# EAGLE design ESP-07 (EAGLE 7.7.0)
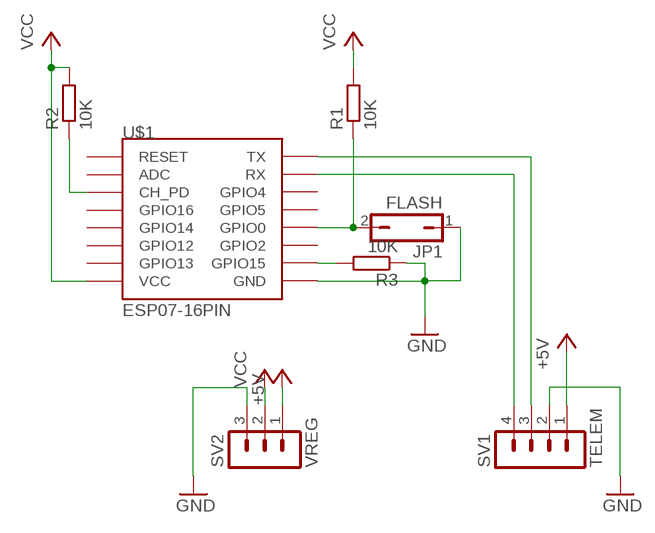
[diagram p0: schematic, sheet 1]

## Parts
JP1  FLASH  JP1Q  [JP1]
R1  10K  R-EU_R0805  [R0805]
R2  10K  R-EU_R0805  [R0805]
R3  10K  R-EU_R0805  [R0805]
SV1  TELEM  MA04-1  [MA04-1]
SV2  VREG  MA03-1  [MA03-1]
U$1  ESP07-16PIN  [ESP07-16PIN]

## Nets
+5V: SV1.1 SV2.1
GND: JP1.1 R3.1 SV1.2 SV2.3 U$1.GND
N$1: JP1.2 R1.1 U$1.GPIO0
N$2: SV1.3 U$1.TX
N$3: SV1.4 U$1.RX
N$4: R3.2 U$1.GPIO15
N$6: R2.1 U$1.CH_PD
VCC: R1.2 R2.2 SV2.2 U$1.VCC
Unconnected: U$1.ADC U$1.GPIO2 U$1.GPIO4 U$1.GPIO5 U$1.GPIO12 U$1.GPIO13 U$1.GPIO14 U$1.GPIO16 U$1.REST(RESET)

## Library data of the parts
JP1 = jumper:JP1Q: JUMPER
R1-R3 = rcl:R-EU_: RESISTOR, European symbol
SV1 = con-lstb:MA04-1: PIN HEADER; OC_FARNELL: unknown; OC_NEWARK: unknown
SV2 = con-lstb:MA03-1: PIN HEADER; OC_FARNELL: unknown; OC_NEWARK: unknown
U$1 = esp8266modules:ESP07-16PIN: ESP8266 Wifi module 07 - 16 pins; DIMENSIONS: 22.0 x 16.0 mm; PINS: 16; PITCH: 0.078" / 2 mm

## Board
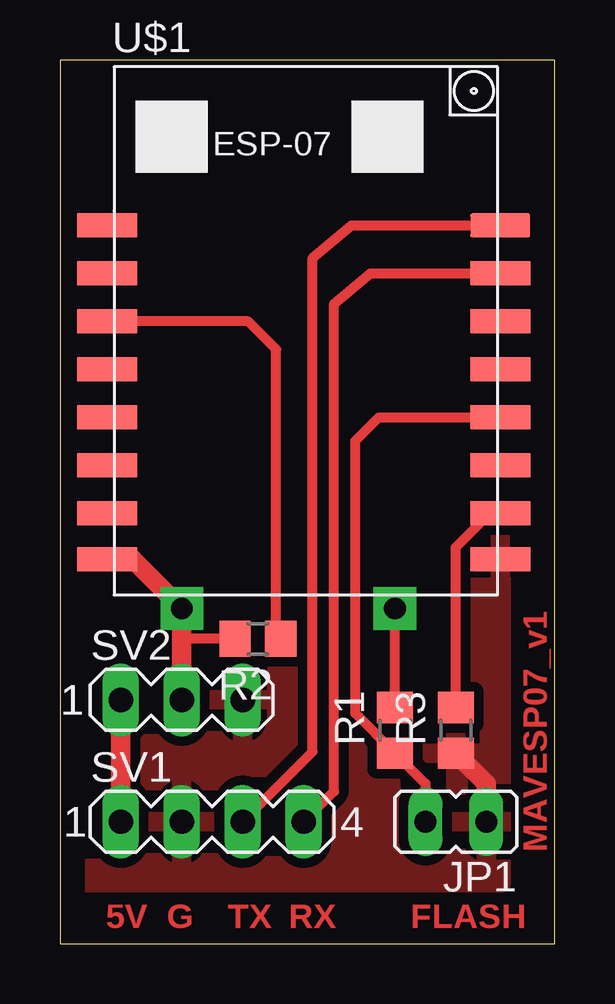
[diagram p1: board, top side]
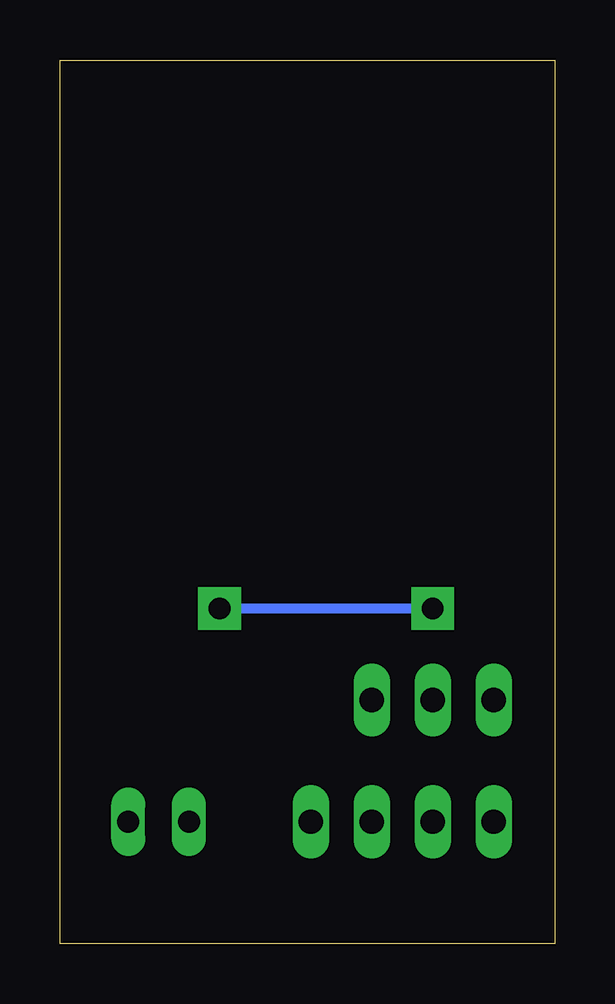
[diagram p2: board, bottom side, seen from below]

Size 20.62 x 36.82 mm. Coordinates in mm from the lower left corner, seen from the top.
Outline: 0,0 20.62,0 20.62,36.82 0,36.82 0,0
Copper layers (1*16): Top 0.035mm / dielectric 1.5mm / Bottom 0.035mm
Design rules "default": minimum track width 10mil, minimum drill 24mil, track to track 8mil, track to pad 8mil, pad to pad 8mil, via to via 8mil, smd to smd 8mil, copper to edge 40mil, drill to drill 8mil, minimum pad ring 10mil, minimum via ring 8mil, stop-mask expansion 4mil, vias tented up to drill 0mil, thermal gap 10mil

### Footprints (pad centres in the part's own frame; a part is rotated, then mirrored left to right if it is on the bottom)
JP1 = drill 0.914 long: 1 0,-1.27; 2 0,1.27
R0805 = smd 1.3 x 1.5: 1 -0.95,0; 2 0.95,0
MA04-1 = drill 1.016 long: 1 -3.81,0; 2 -1.27,0; 3 1.27,0; 4 3.81,0
MA03-1 = drill 1.016 long: 1 -2.54,0; 2 0,0; 3 2.54,0
ESP07-16PIN = smd 2.5 x 1: ADC -8.2,3.8; CH_PD -8.2,1.8; GND 8.2,-8.105; GPIO0 8.2,-2.2; GPIO2 8.2,-4.2; GPIO4 8.2,1.8; GPIO5 8.2,-0.2; GPIO12 -8.2,-4.2; GPIO13 -8.2,-6.2; GPIO14 -8.2,-2.2; GPIO15 8.2,-6.2; GPIO16 -8.2,-0.2; REST -8.2,5.8; RX 8.2,3.8; TX 8.2,5.8; VCC -8.2,-8.105

### Placement (x,y rotation side)
JP1  16.51,5.08 90 top
R1  13.97,8.89 90 top
R2  8.26,12.7 180 top
R3  16.51,8.89 90 top
SV1  6.35,5.08 0 top
SV2  5.08,10.16 0 top
U$1  10.16,24.13 0 top

### Tracks (layer width: path | path; a pad name or v marks a point on that pad's centre or on a via)
+5V
  Top 0.813: SV2.1 SV1.1
GND
  Top 0.813: R3.1 17.78,6.67 JP1.1
  pour Top (isolate 0.406, rank 6): 0.63,2.54 18.41,2.54 18.41,17.78 15.24,17.78 15.24,13.97 0.63,13.97
N$1
  Top 0.406: JP1.2 15.24,6.67 R1.1 12.32,9.59 12.32,20.96 13.29,21.93 U$1.GPIO0
N$2
  Top 0.406: SV1.3 10.54,8 10.54,28.57 12.15,29.93 U$1.TX
N$3
  Top 0.406: SV1.4 11.43,6.35 11.43,26.67 12.94,27.93 U$1.RX
N$4
  Top 0.406: R3.2 16.51,16.51 17.93,17.93 U$1.GPIO15
N$6
  Top 0.406: R2.1 9.02,13.01 9.02,24.77 7.85,25.93 U$1.CH_PD
VCC  (via drill 0.9 pad 1.78)
  Top 0.406: 1.96,15.93 U$1.VCC | R1.2 v13.97,13.97 | R2.2 5.08,12.7
  Top 0.813: SV2.2 5.08,12.7 v5.08,13.97 3.03,16.03 U$1.VCC
  Bottom 0.406: v13.97,13.97 v5.08,13.97

### Text on the board
Top: MAVESP07_v1 | 5V | G | TX | RX | FLASH